# Altium schematic sheet Power.SchDoc
size B; SheetNumber: 4; SheetTotal: 4
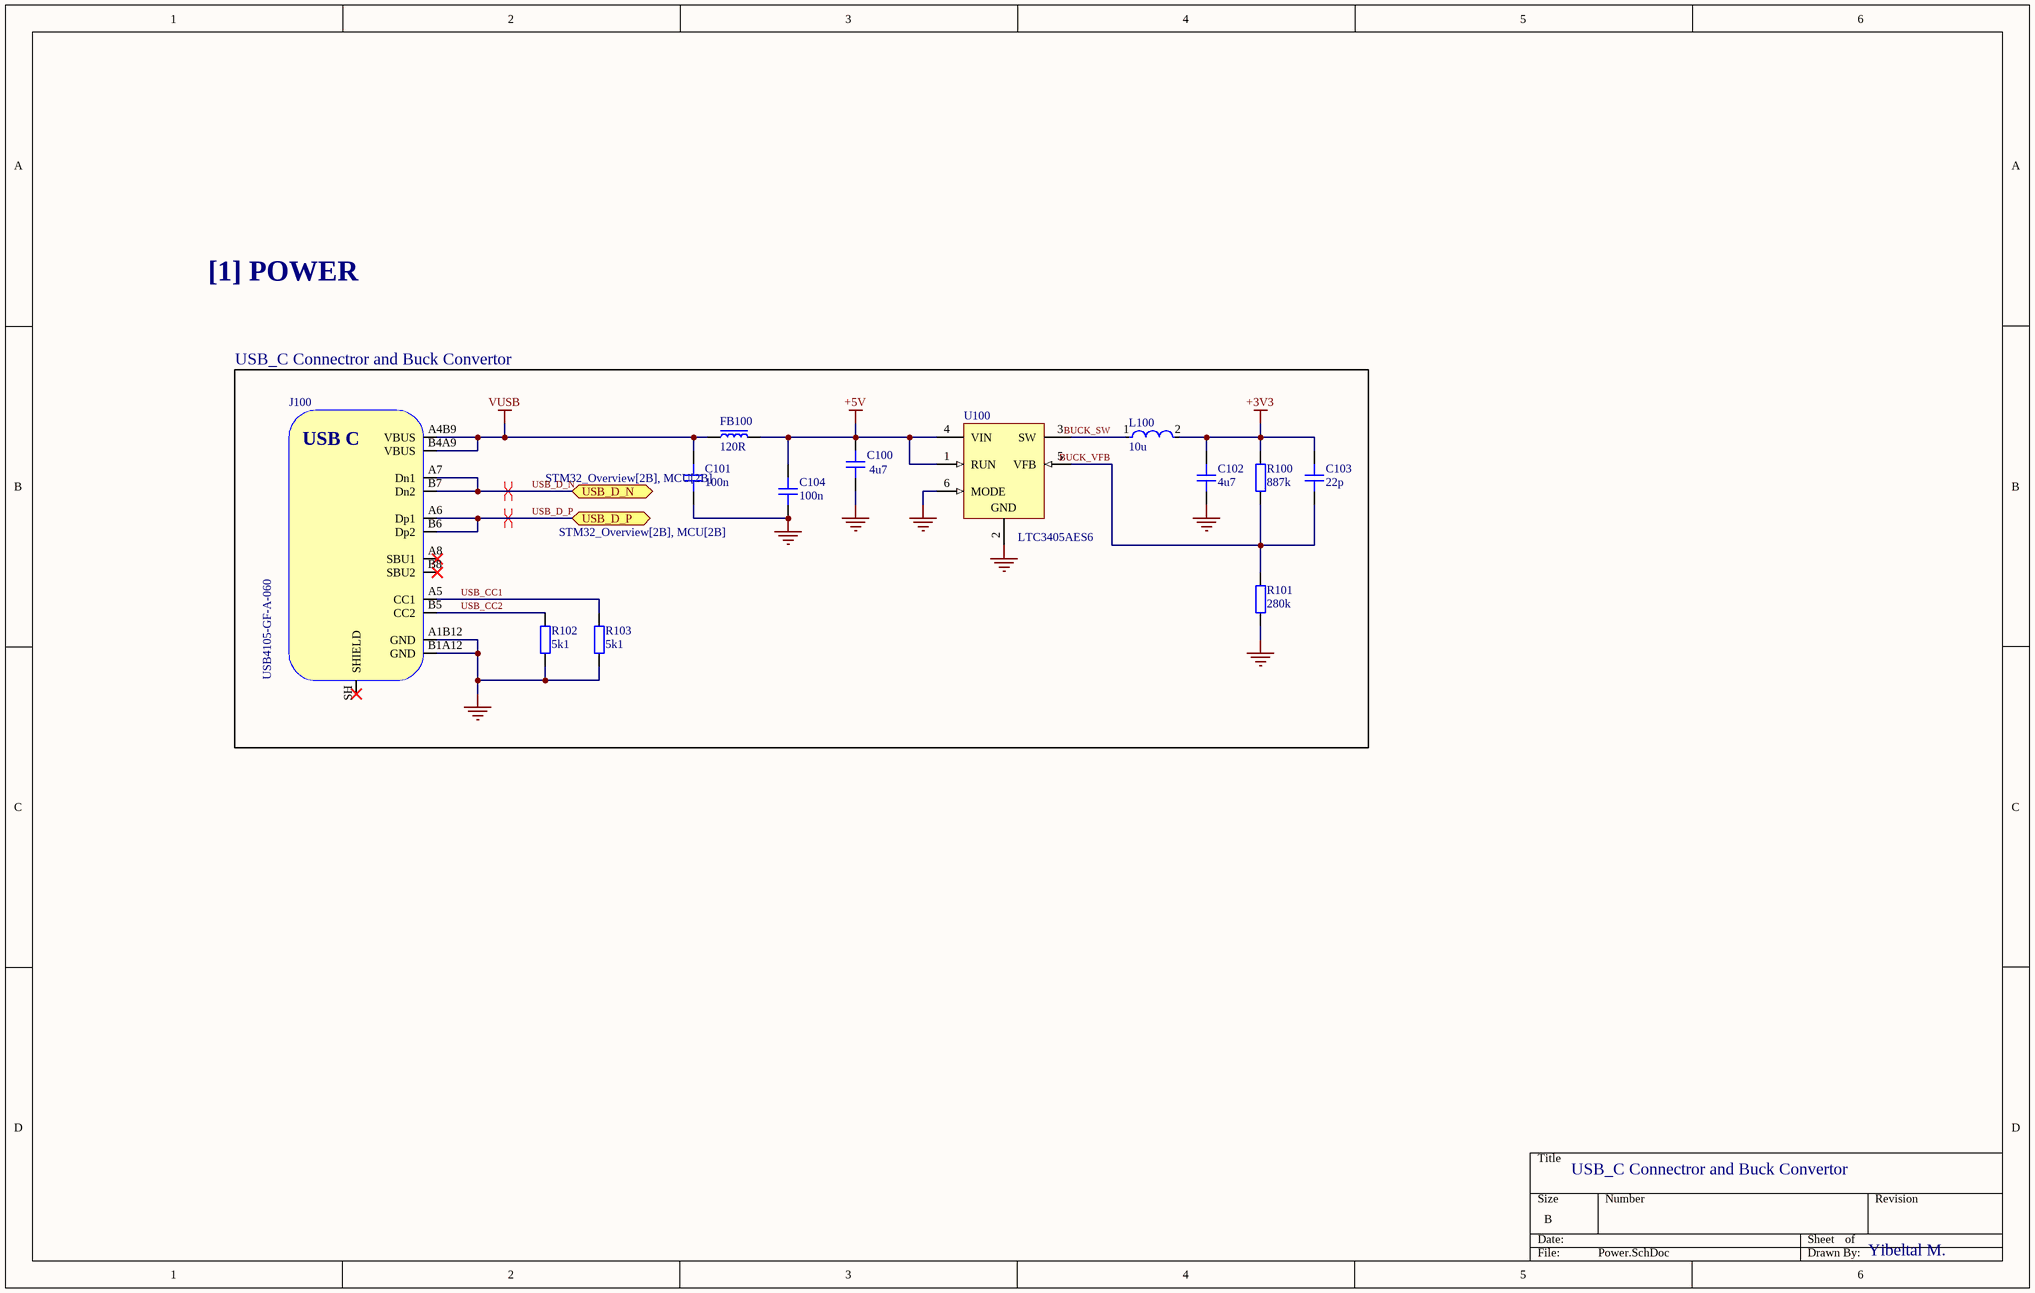
[diagram p0: Power.SchDoc]

## Parts
C100  4u7  [CAP_0805]
C101  100n  [CAP_0805]
C102  4u7  [CAP_0805]
C103  22p  [CAP_0805]
C104  100n  [CAP_0805]
FB100  120R  [FB_0603]
J100  USB4105-GF-A-060  [USB4105-GF-A-060]
L100  10u  [FP-NRH2412-MFG]
R100  887k  [RES_0603]
R101  280k  [RES_0603]
R102  5k1  [RES_0603]
R103  5k1  [RES_0603]
U100  LTC3405AES6  [LT-S6-6-TSOT-23_L]

## Blocks framed on the sheet
USB_C Connectror and Buck Convertor: C100-C104 FB100 J100 L100 R100-R103 U100

## Ports
USB_D_N (bidir, see STM32_Overview[2B], MCU[2B]), USB_D_P (bidir, see STM32_Overview[2B], MCU[2B])

## Nets
+3V3: C102.2 C103.2 L100.2 R100.2
+5V: C100.2 C104.2 FB100.2 U100.1(RUN) U100.4(VIN)
GND: C100.1 C101.1 C102.1 C104.1 J100.A1B12(GND) J100.B1A12(GND) R101.1 R102.1 R103.1 U100.2(GND) U100.6(MODE)
VUSB: C101.2 FB100.1 J100.A4B9(VBUS) J100.B4A9(VBUS)
BUCK_SW: L100.1 U100.3(SW)
BUCK_VFB: C103.1 R100.1 R101.2 U100.5(VFB)
USB_CC1: J100.A5(CC1) R103.2
USB_CC2: J100.B5(CC2) R102.2
USB_D_N: J100.A7(Dn1) J100.B7(Dn2) ; port USB_D_N
USB_D_P: J100.A6(Dp1) J100.B6(Dp2) ; port USB_D_P

Not connected (* = marked no-connect by the designer): J100 A8(SBU1)* B8(SBU2)* SH(SHIELD)*

## Layout directives
differential pair: USB_D_N, USB_D_P

## Notes on the sheet
- [1] POWER
- USB_C Connectror and Buck Convertor
- Yibeltal M.
- (in symbol USB4105-GF-A-060) USB C

## Library data of the parts
C100-C104 = CAP_0805: Capacitor SMD 0805; Manufacturer: *; Manufacturer Part Number: *; Distributor Link: *; LCSC: *; Rating: *; Dielectric: *
FB100 = FB_0603: Ferrite Bead SMD 0603; Manufacturer: *; Manufacturer Part Number: *; Distributor Link: *; LCSC: *
J100 = USB4105-GF-A-060: USB Connector Type C SMT 12 Pin; Manufacturer: GCT; Manufacturer Part Number: USB4105-GF-A-060; Distributor Link: https://eu.mouser.com/ProductDetail/GCT/USB4105-GF-A-060?qs=QNEnbhJQKvY2mocwNJzgfA%3D%3D
L100 = CMP-14484-000582-1: Shielded Wirewound Inductor 10uH 20% 0.51A 0.72Ω SMD; DC Resistance (DCR): 600mR; Current Rating: 450mA; Saturation Current: 810mA; Core Material: Ferrite; Test Frequency: 100kHz; Self Resonant Frequency: 29MHz; Termination: SMD/SMT; Shielding: Shielded; Height - Seated (Max): 0.047inch; Case/Package: Nonstandard; Tolerance: 20%; Height: 1.2mm; Package Quantity: 2500; Mount: Surface Mount; Min Operating Temperature: -25°C; Inductance: 10uH; Width: 0.095inch; Length: 0.095inch; RoHS Compliant: Yes; Max DC Current: 810mA; Packaging: Tape and Reel; Max Operating Temperature: 120°C; Halogen Free: Halogen Free
R100-R103 = RES_0603: Resistor SMD 0603; Manufacturer: *; Manufacturer Part Number: *; Distributor Link: *; LCSC: *
U100 = CMP-0492-01706-1: 1.5 MHz, 300 mA Synchronous Step-Down Regulator, 6-pin SOT23 (S6-6), -40 to 85 degC, Pb-Free, Mini Tape and Reel; PartNumber: LTC3405AES6#TRMPBF; Manufacturer: Linear Technology; Number of Outputs: 1; ComponentLink1Description: Manufacturer URL; Packing: Mini Tape and Reel; RoHS: TRUE; PackageVersion: Jun-10; PackageReference: S6-6; ComponentLink2Description: Datasheet; ComponentLink2URL: http://cds.linear.com/docs/en/datasheet/3405afa.pdf; PackageDescription: 6-Pin Plastic TSOT-23, Body 2.9 x 1.63 mm, Pitch 0.95 mm; Mounting Technology: Surface Mount; Code_JEDEC: MO-193; ComponentLink3URL: http://cds.linear.com/docs/en/packaging/SOT_6_05-08-1636.pdf; DatasheetVersion: Rev. A; ComponentLink1URL: http://www.linear.com/; ComponentLink3Description: Package Specification